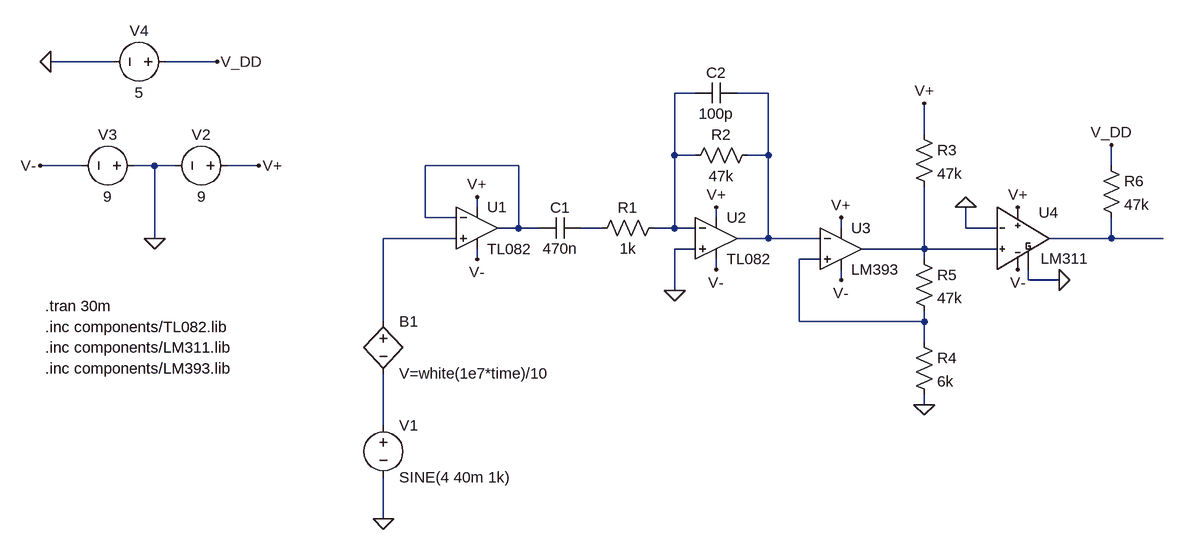
[diagram p0: schematic ir-detector.asc]
ir-detector.asc, the LTspice schematic file:
Version 4
SHEET 1 5268 716
WIRE -192 -400 -288 -400
WIRE -32 -400 -112 -400
WIRE 704 -352 672 -352
WIRE 816 -352 768 -352
WIRE 1056 -288 1056 -336
WIRE 672 -256 672 -352
WIRE 704 -256 672 -256
WIRE 816 -256 816 -352
WIRE 816 -256 784 -256
WIRE -240 -240 -304 -240
WIRE -128 -240 -160 -240
WIRE -96 -240 -128 -240
WIRE 32 -240 -16 -240
WIRE 432 -240 288 -240
WIRE 1344 -240 1344 -272
WIRE 368 -176 368 -192
WIRE 288 -160 288 -240
WIRE 336 -160 288 -160
WIRE 736 -160 736 -176
WIRE 1200 -160 1200 -176
WIRE 432 -144 432 -240
WIRE 432 -144 400 -144
WIRE 464 -144 432 -144
WIRE 560 -144 528 -144
WIRE 672 -144 672 -256
WIRE 672 -144 640 -144
WIRE 704 -144 672 -144
WIRE 928 -144 928 -160
WIRE 1120 -144 1120 -176
WIRE 1168 -144 1120 -144
WIRE -128 -128 -128 -240
WIRE 336 -128 224 -128
WIRE 816 -128 816 -256
WIRE 816 -128 768 -128
WIRE 896 -128 816 -128
WIRE 1344 -128 1344 -160
WIRE 1344 -128 1248 -128
WIRE 1424 -128 1344 -128
WIRE 704 -112 672 -112
WIRE 1056 -112 1056 -208
WIRE 1056 -112 960 -112
WIRE 1168 -112 1056 -112
WIRE 368 -96 368 -112
WIRE 896 -96 864 -96
WIRE 1056 -96 1056 -112
WIRE 736 -80 736 -96
WIRE 1200 -80 1200 -96
WIRE 928 -64 928 -80
WIRE 1216 -64 1216 -80
WIRE 1264 -64 1216 -64
WIRE 672 -48 672 -112
WIRE 224 0 224 -128
WIRE 864 0 864 -96
WIRE 1056 0 1056 -16
WIRE 1056 0 864 0
WIRE 1056 32 1056 0
WIRE 1056 128 1056 112
WIRE 224 160 224 80
WIRE 224 304 224 240
FLAG 368 -192 V+
FLAG 368 -96 V-
FLAG 736 -176 V+
FLAG 736 -80 V-
FLAG -128 -128 0
FLAG 32 -240 V+
FLAG -304 -240 V-
FLAG 672 -48 0
FLAG 928 -160 V+
FLAG 1056 128 0
FLAG 1056 -336 V+
FLAG 928 -64 V-
FLAG -32 -400 V_DD
FLAG 1200 -176 V+
FLAG 1200 -80 V-
FLAG 1120 -176 0
FLAG 1344 -272 V_DD
FLAG -288 -400 0
FLAG 1264 -64 0
FLAG 224 304 0
SYMBOL voltage 224 144 R0
WINDOW 123 0 0 Left 0
WINDOW 39 0 0 Left 0
SYMATTR InstName V1
SYMATTR Value SINE(4 40m 1k)
SYMBOL bv 224 -16 R0
SYMATTR InstName B1
SYMATTR Value V=white(1e7*time)/10
SYMBOL Opamps\\opamp2 368 -208 R0
SYMATTR InstName U1
SYMATTR Value TL082
SYMBOL Opamps\\opamp2 736 -192 R0
SYMATTR InstName U2
SYMATTR Value TL082
SYMBOL cap 528 -160 R90
WINDOW 0 0 32 VBottom 2
WINDOW 3 32 32 VTop 2
SYMATTR InstName C1
SYMATTR Value 470n
SYMBOL res 656 -160 R90
WINDOW 0 0 56 VBottom 2
WINDOW 3 32 56 VTop 2
SYMATTR InstName R1
SYMATTR Value 1k
SYMBOL res 800 -272 R90
WINDOW 0 0 56 VBottom 2
WINDOW 3 32 56 VTop 2
SYMATTR InstName R2
SYMATTR Value 47k
SYMBOL cap 768 -368 R90
WINDOW 0 0 32 VBottom 2
WINDOW 3 32 32 VTop 2
SYMATTR InstName C2
SYMATTR Value 100p
SYMBOL voltage 0 -240 R90
WINDOW 0 -32 56 VBottom 2
WINDOW 3 32 56 VTop 2
WINDOW 123 0 0 Left 0
WINDOW 39 0 0 Left 0
SYMATTR InstName V2
SYMATTR Value 9
SYMBOL voltage -144 -240 R90
WINDOW 0 -32 56 VBottom 2
WINDOW 3 32 56 VTop 2
WINDOW 123 0 0 Left 0
WINDOW 39 0 0 Left 0
SYMATTR InstName V3
SYMATTR Value 9
SYMBOL Opamps\\opamp2 928 -176 R0
SYMATTR InstName U3
SYMATTR Value LM393
SYMBOL res 1040 16 R0
SYMATTR InstName R4
SYMATTR Value 6k
SYMBOL res 1040 -304 R0
SYMATTR InstName R3
SYMATTR Value 47k
SYMBOL res 1040 -112 R0
SYMATTR InstName R5
SYMATTR Value 47k
SYMBOL voltage -96 -400 R90
WINDOW 0 -32 56 VBottom 2
WINDOW 3 32 56 VTop 2
WINDOW 123 0 0 Left 0
WINDOW 39 0 0 Left 0
SYMATTR InstName V4
SYMATTR Value 5
SYMBOL LM311 1200 -128 R0
WINDOW 3 35 31 Left 2
SYMATTR Value LM311
SYMATTR InstName U4
SYMBOL res 1328 -256 R0
SYMATTR InstName R6
SYMATTR Value 47k
TEXT -296 -24 Left 2 !.tran 30m
TEXT -296 8 Left 2 !.inc components/TL082.lib
TEXT -296 40 Left 2 !.inc components/LM311.lib
TEXT -296 72 Left 2 !.inc components/LM393.lib

The netlist it stands for:
* ir-detector.asc
V1 N009 0 SINE(4 40m 1k)
B1 N005 N009 V=white(1e7*time)/10
XU1 N005 N003 V+ V- N003 TL082  ; pins In+ In- V+ V- OUT
XU2 0 N001 V+ V- N002 TL082  ; pins In+ In- V+ V- OUT
C1 N004 N003 470n
R1 N001 N004 1k
R2 N002 N001 47k
C2 N002 N001 100p
V2 V+ 0 9
V3 0 V- 9
XU3 N008 N002 V+ V- N007 LM393  ; pins In+ In- V+ V- OUT
R4 N008 0 6k
R3 V+ N007 47k
R5 N007 N008 47k
V4 V_DD 0 5
XU4 N007 0 V+ V- N006 0 LM311  ; pins In+ In- VCC VEE OUT+ LATCH
R6 V_DD N006 47k
.tran 30m
.inc components/TL082.lib
.inc components/LM311.lib
.inc components/LM393.lib
.backanno
.end